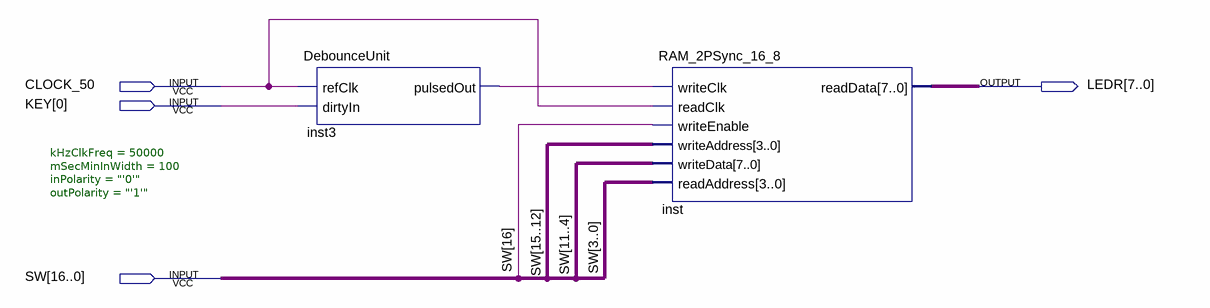
[diagram p0: schematic sheet]
// Quartus schematic RAM_2PSync_Demo.bdf as structural Verilog: 2 symbols, 4 pins
module RAM_2PSync_Demo (
  input  CLOCK_50,
  input  [0:0] KEY,
  input  [16:0] SW,
  output [7:0] LEDR
);

  wire inst3_pulsedout;

  DebounceUnit #(.kHzClkFreq(50000), .mSecMinInWidth(100), .inPolarity("'0'"), .outPolarity("'1'")) inst3 (
    .refClk(CLOCK_50), .dirtyIn(KEY[0]), .pulsedOut(inst3_pulsedout));
  RAM_2PSync_16_8 inst (
    .writeClk(inst3_pulsedout), .readClk(CLOCK_50), .writeEnable(SW[16]), .writeAddress(SW[15:12]),
    .writeData(SW[11:4]), .readAddress(SW[3:0]), .readData(LEDR));
endmodule
